# Altium schematic sheet MainBoard.SchDoc
size A3
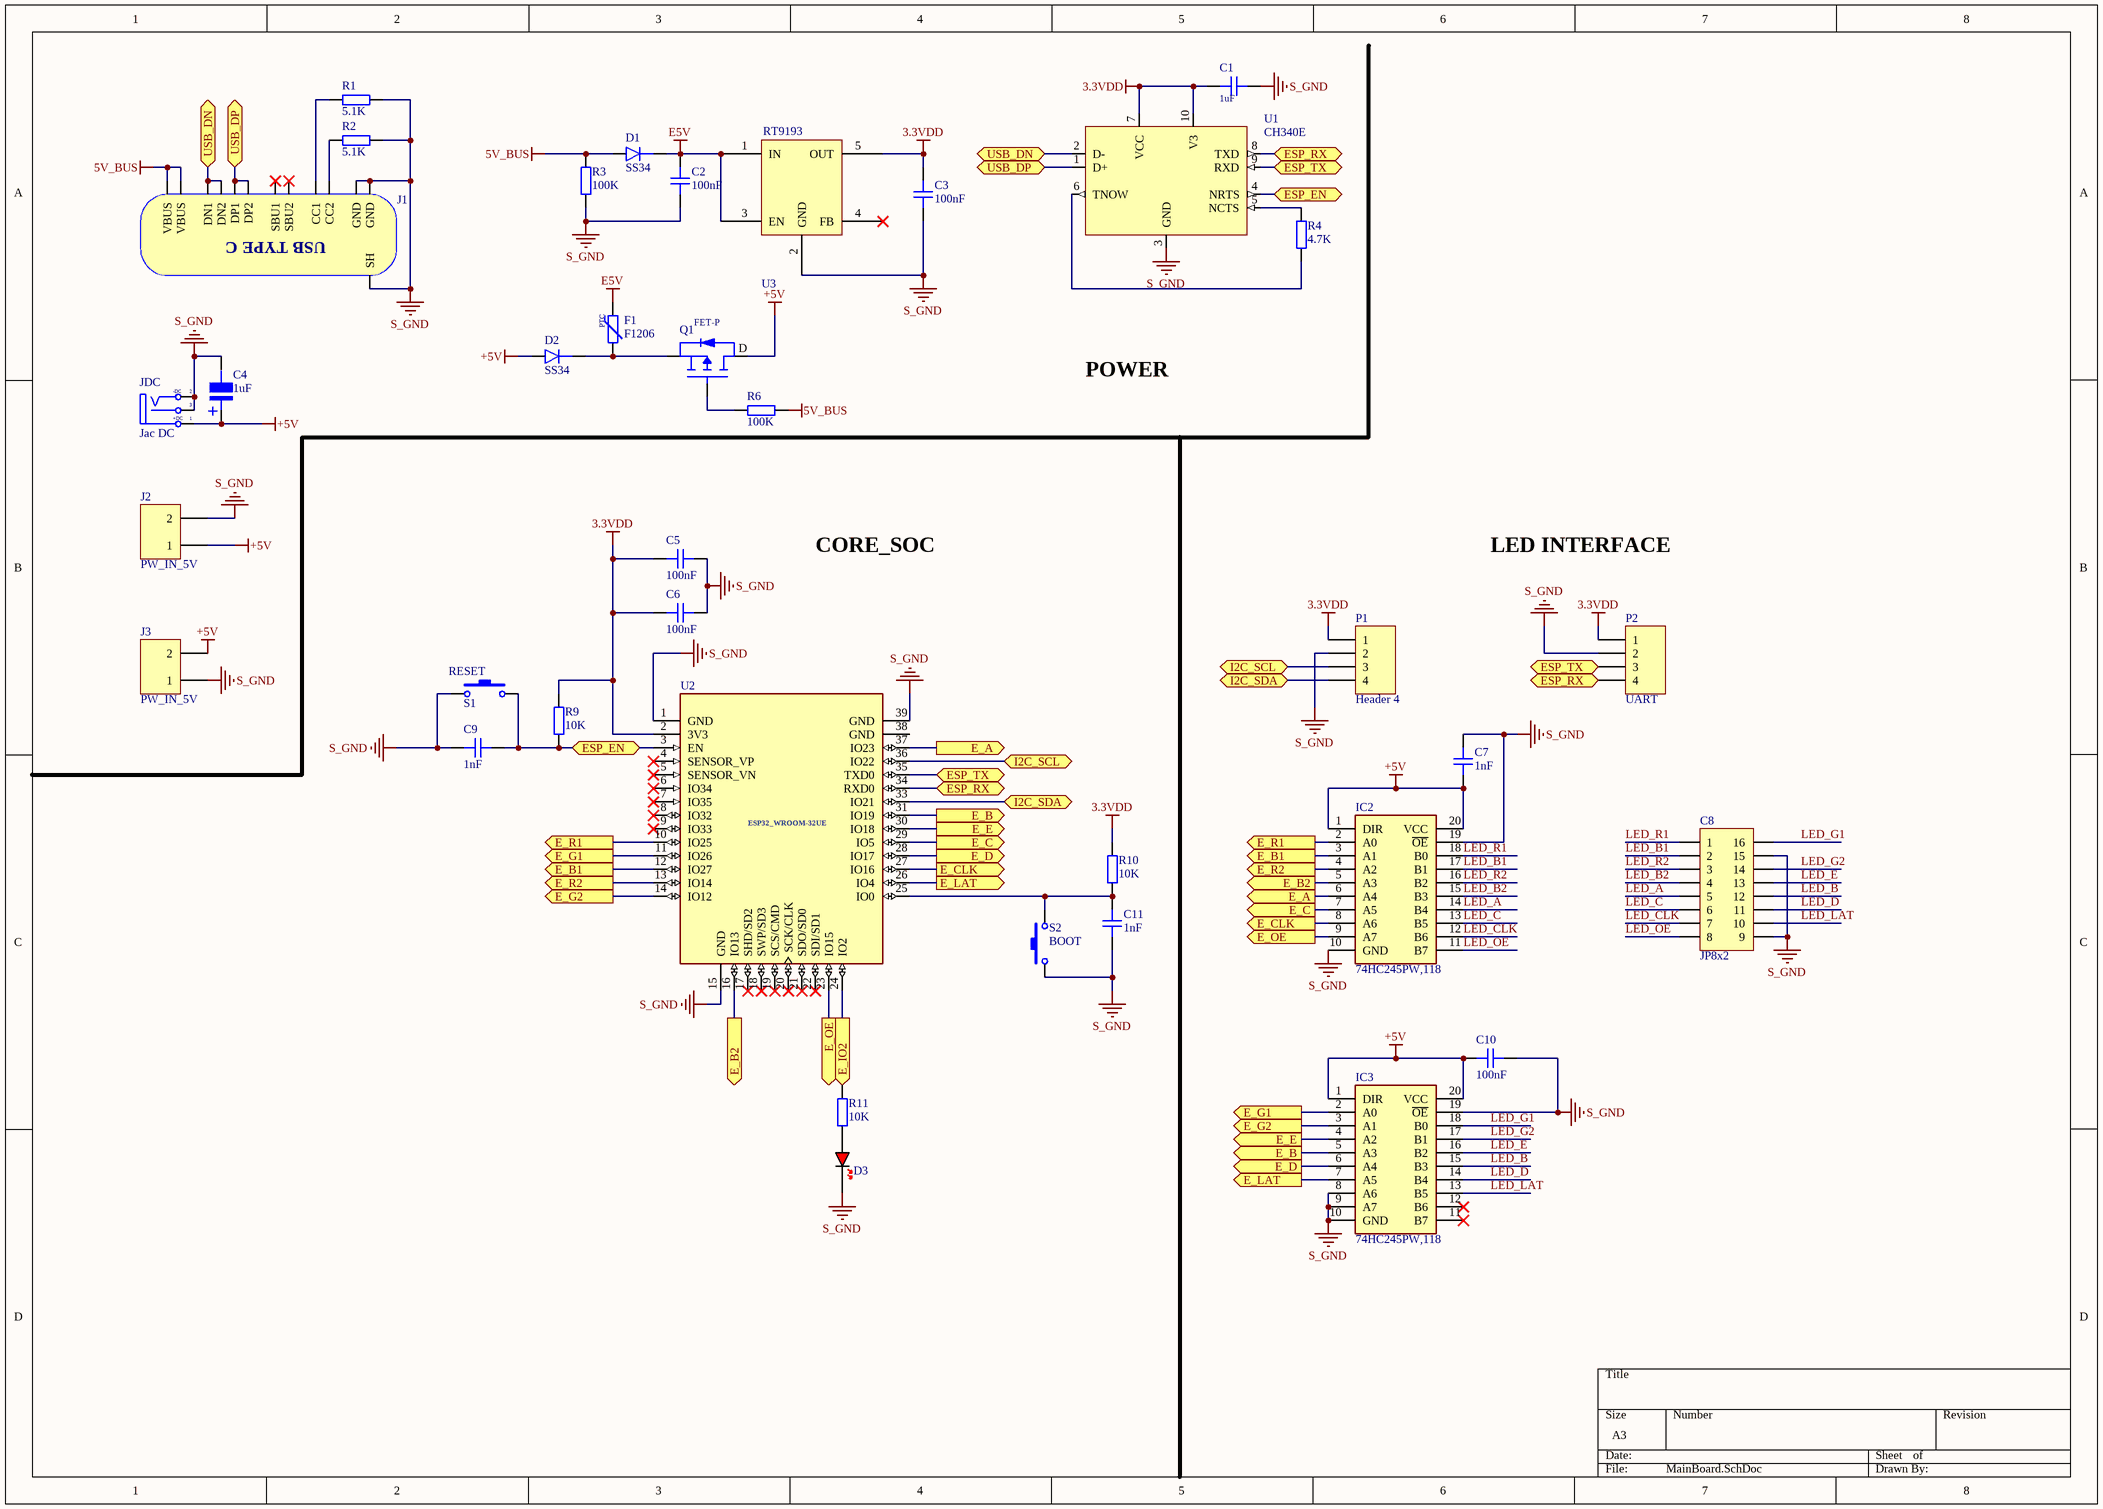
[diagram p0: MainBoard.SchDoc]

## Parts
C1  1uF  [CAP_0805]
C2  100nF  [CAP_0603]
C3  100nF  [CAP_0603]
C4  1uF  [tu nhom 4 (B)]
C5  100nF  [CAP_0603]
C6  100nF  [CAP_0603]
C7  1nF  [CAP_0603]
C8  JP8x2  [JP8-C2T]
C9  1nF  [CAP_0603]
C10  100nF  [CAP_0603]
C11  1nF  [CAP_0603]
D1  SS34  [DO-214AC-2 (SMA)]
D2  SS34  [DO-214AC-2 (SMA)]
D3  RED  [LED_0603_RED]  (value not drawn)
F1  F1206  [FUSE_1206]
IC2  74HC245PW,118  [74hc245pw]
IC3  74HC245PW,118  [74hc245pw]
J1  TYPE-C-31-M-12  [TYPE-C-31-M-12]  (value not drawn)
J2  PW_IN_5V  [DOMINO 2L]
J3  PW_IN_5V  [DOMINO 2L]
JDC  Jac DC  [DC-IN]
P1  Header 4  [JP4]
P2  UART  [JP4]
Q1  FET-P  [SSM3J338R,LF-SOT23-F]
R1  5.1K  [RES_0402]
R2  5.1K  [RES_0402]
R3  100K  [RES_0402]
R4  4.7K  [RES_0402]
R6  100K  [RES_0402]
R9  10K  [RES_0402]
R10  10K  [RES_0402]
R11  10K  [RES_0402]
S1  RESET  [SW-SMD]
S2  BOOT  [SW-SMD]
U1  CH340E  [MSOP-10]
U2  ESP32-WROOM-32D  [MODULE_ESP32-WROOM-32D]  (value not drawn)
U3  RT9193-33  [RT9193_33]  (value not drawn)

## Ports
E_A (out), E_B1 (out), E_B2 (out), E_B (out), E_C (out), E_CLK (out), E_D (out), E_E (out), E_G1 (out), E_G2 (out), E_IO2 (out), E_LAT (out), E_OE (out), E_R1 (out), E_R2 (out), ESP_EN (bidir), ESP_RX (bidir), ESP_TX (bidir), I2C_SCL (bidir), I2C_SDA (bidir), USB_DN (bidir), USB_DP (bidir)

## Nets
3.3VDD: C1.2 C3.2 C5.2 C6.2 P1.1 P2.1 R9.2 R10.2 U1.7(VCC) U1.10(V3) U2.2(3V3) U3.5(OUT)
5V_BUS: D1.A J1.A4B9(VBUS) J1.B4A9(VBUS) R3.2 R6.1
+5V: C4.1 C7.2 C10.1 D2.A IC2.1(DIR) IC2.20(VCC) IC3.1(DIR) IC3.20(VCC) J2.1 J3.2 JDC.1(T) Q1.D
E5V: C2.2 D1.K F1.2 U3.1(IN) U3.3(EN)
S_GND: C1.1 C2.1 C3.1 C4.2 C5.1 C6.1 C7.1 C8.9 C8.15 C9.2 C10.2 C11.2 D3.K IC2.10(GND) IC2.19(~{OE}) IC3.8(A6) IC3.9(A7) IC3.10(GND) IC3.19(~{OE}) J1.A1B12(GND) J1.B1A12(GND) J1.SH J2.2 J3.1 JDC.2(TN) JDC.3(S) P1.2 P2.2 R1.2 R2.2 R3.1 S1.1 S2.1 U1.3(GND) U2.1(GND) U2.15(GND) U2.39(GND) U3.2(GND)
E_A: IC2.6(A4) U2.37(IO23) ; port E_A
E_B: IC3.5(A3) U2.31(IO19) ; port E_B
E_B1: IC2.3(A1) U2.12(IO27) ; port E_B1
E_B2: IC2.5(A3) U2.16(IO13) ; port E_B2
E_C: IC2.7(A5) U2.29(IO5) ; port E_C
E_CLK: IC2.8(A6) U2.27(IO16) ; port E_CLK
E_D: IC3.6(A4) U2.28(IO17) ; port E_D
E_E: IC3.4(A2) U2.30(IO18) ; port E_E
E_G1: IC3.2(A0) U2.11(IO26) ; port E_G1
E_G2: IC3.3(A1) U2.14(IO12) ; port E_G2
E_IO2: R11.2 U2.24(IO2) ; port E_IO2
E_LAT: IC3.7(A5) U2.26(IO4) ; port E_LAT
E_OE: IC2.9(A7) U2.23(IO15) ; port E_OE
E_R1: IC2.2(A0) U2.10(IO25) ; port E_R1
E_R2: IC2.4(A2) U2.13(IO14) ; port E_R2
ESP_EN: C9.1 R9.1 S1.2 U1.4(NRTS) U2.3(EN) ; port ESP_EN
ESP_RX: P2.4 U1.8(TXD) U2.34(RXD0) ; port ESP_RX
ESP_TX: P2.3 U1.9(RXD) U2.35(TXD0) ; port ESP_TX
I2C_SCL: P1.3 U2.36(IO22) ; port I2C_SCL
I2C_SDA: P1.4 U2.33(IO21) ; port I2C_SDA
LED_A: C8.5 IC2.14(B4)
LED_B: C8.12 IC3.15(B3)
LED_B1: C8.2 IC2.17(B1)
LED_B2: C8.4 IC2.15(B3)
LED_C: C8.6 IC2.13(B5)
LED_CLK: C8.7 IC2.12(B6)
LED_D: C8.11 IC3.14(B4)
LED_E: C8.13 IC3.16(B2)
LED_G1: C8.16 IC3.18(B0)
LED_G2: C8.14 IC3.17(B1)
LED_LAT: C8.10 IC3.13(B5)
LED_OE: C8.8 IC2.11(B7)
LED_R1: C8.1 IC2.18(B0)
LED_R2: C8.3 IC2.16(B2)
USB_DN: J1.A7(DN1) J1.B7(DN2) U1.2(D-) ; port USB_DN
USB_DP: J1.A6(DP1) J1.B6(DP2) U1.1(D+) ; port USB_DP
NetC11_1: C11.1 R10.1 S2.2 U2.25(IO0)
NetD2_K: D2.K F1.1 Q1.S
NetD3_A: D3.A R11.1
NetJ1_A5: J1.A5(CC1) R1.1
NetJ1_B5: J1.B5(CC2) R2.1
NetQ1_G: Q1.G R6.2
NetR4_1: R4.1 U1.6(TNOW)
NetR4_2: R4.2 U1.5(NCTS)

Not connected (* = marked no-connect by the designer): IC3 11(B7)* 12(B6)*; J1 A8(SBU1)* B8(SBU2)*; U2 4(SENSOR_VP)* 5(SENSOR_VN)* 6(IO34)* 7(IO35)* 8(IO32)* 9(IO33)* 17(SHD/SD2)* 18(SWP/SD3)* 19(SCS/CMD)* 20(SCK/CLK)* 21(SDO/SD0)* 22(SDI/SD1)* 38(GND); U3 4(FB)*

## Notes on the sheet
- POWER
- CORE_SOC
- LED INTERFACE
- (in symbol DCIN) -DC; +DC
- (in symbol ESP32-WROOM-32D) ESP32_WROOM-32UE
- (in symbol FUSE_PPTC_1206) PTC
- (in symbol RT9193-33) RT9193
- (in symbol Tu Nhom 1uF 50V) +
- (in symbol TYPE-C-31-M-12) USB TYPE C

## Library data of the parts
C1 = CAP_0805_50V: Capacitor SMD 0805 50V
C2 C3 C5-C7 C9-C11 = CAP_0603_50V: Capacitor SMD 0603 50V
C4 = Tu Nhom 1uF 50V: Dán; Don_Vi: Con; So_Chan: 2; Ten_Linh_Kien: Tụ Nhôm 1uF 50V 4x5.4MM; Ma_Hang: MH007467; Chung_Loai: Dán; Kieu_Chan: *
C8 = JP8x2: WR-PHD 2.54 mm Dual Socket Header; Manufacturer: W¨¹rth Elektronik eiSos GmbH; partNo: 61301621821; ComponentLink1 Description: Manufacturer; ComponentLink2 Description: Datasheet; NoPins: 16; Created Date: 29 March 2013; ComponentLink1URL: http://www.we-online.com; ComponentLink2URL: http://katalog.we-online.de/em/datasheet/6130xx21821.pdf; Created by: Karrer Zheng
D1 D2 = D_SMA: Diode SMD SMA (DO-214AA)
D3 = LED_0603_RED: LED 0603 RED SMD
F1 = FUSE_PPTC_1206: Fuse PPTC SMD 1206; Manufacturer: *; Manufacturer Part Number: *
IC2 IC3 = 74HC245PW,118: Integrated Circuit; Manufacturer_Name: Nexperia; Datasheet Link: https://assets.nexperia.com/documents/data-sheet/74HC_HCT245.pdf; Height: 1.1mm; Manufacturer_Part_Number: 74HC245PW,118; Mouser Part Number: 771-HC245PW118; Mouser Price/Stock: https://www.mouser.co.uk/ProductDetail/Nexperia/74HC245PW118?qs=P62ublwmbi81WTOw8gvz3Q%3D%3D; Arrow Part Number: 74HC245PW,118; Arrow Price/Stock: https://www.arrow.com/en/products/74hc245pw118/nexperia?region=nac
J1 = TYPE-C-31-M-12: USB Type C Connector Horizontal SMT; Manufacturer: Koren Hroparts; Manufacturer Part Number: TYPE-C-31-M-12
J2 J3 = DOMINO2: WR-TBL Terminal block - serie 311 - 5.08mm; Manufacturer: Würth Elektronik eiSos GmbH; partNo: 691311500002; ComponentLink1 Description: Manufacturer; ComponentLink2 Description: Datasheet; NoPins: 02; Created Date: 9 January 2014; ComponentLink1URL: http://www.we-online.com; ComponentLink2URL: http://katalog.we-online.de/em/datasheet/6913115000xx.pdf; Created by: Karrer Zheng
JDC = DCIN: Jac DC input; Value: Jac DC
P1 P2 = Header 4: Header, 4-Pin, Right Angle; LatestRevisionDate: 17-Jul-2002; LatestRevisionNote: Re-released for DXP Platform.; Publisher: Altium Limited
Q1 = SSM3J338R,LF: MOSFET P-Channel Vds=12V Id=6A; Manufacturer Part Number: Toshiba; Manufacturer: SSM3J338R,LF
R1-R4 R6 R9-R11 = RES_0402: Resistor SMD 0402
S1 S2 = SW-SMD: Switch; Published: 24-Mar-1999; LatestRevisionDate: 17-Jul-2002; LatestRevisionNote: Re-released for DXP Platform.; PackageReference: SPST-2; Publisher: Altium Limited
U1 = CH340E: USB-to-UART Transceiver MSOP-10; Manufacturer Part Number: CH340E
U2 = ESP32-WROOM-32D: Bluetooth, WiFi 802.11b/g/n, Bluetooth v4.2 +EDR, Class 1, 2 and 3 Transceiver Module 2.4GHz ~ 2.5GHz Integrated; MF: Espressif Systems; Price: None; Availability: In Stock; Package: Module Espressif Systems; MP: ESP32-WROOM-32D; Value: *; SnapEDA_Link: https://www.snapeda.com/parts/ESP32-WROOM-32D/Espressif+Systems/view-part/?ref=snap; Purchase-URL: https://pricing.snapeda.com/search/part/ESP32-WROOM-32D/?ref=eda; Check_prices: https://www.snapeda.com/parts/ESP32-WROOM-32D/Espressif+Systems/view-part/?ref=eda